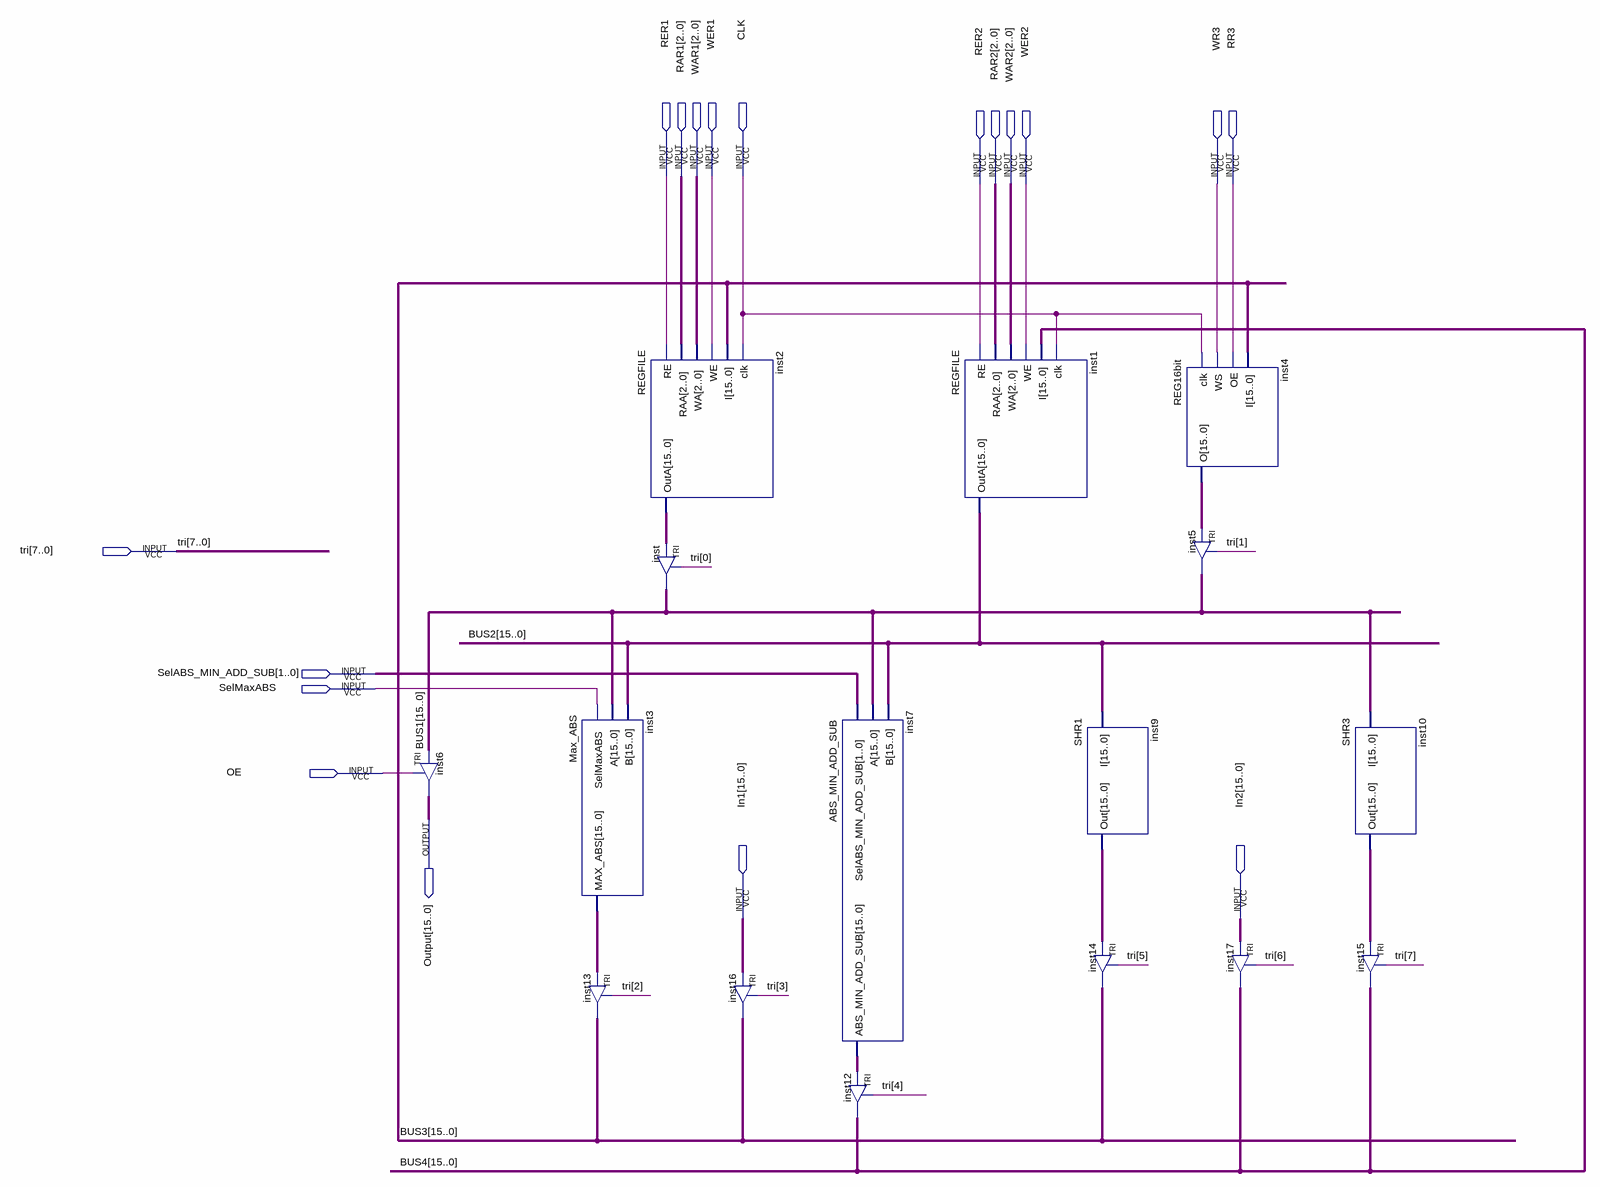
[diagram p0: schematic sheet]
// Quartus schematic Datapath.bdf as structural Verilog: 16 symbols, 18 pins
module Datapath (
  input  RER1,
  input  [2:0] RAR1,
  input  [2:0] WAR1,
  input  WER1,
  input  CLK,
  input  RER2,
  input  [2:0] RAR2,
  input  [2:0] WAR2,
  input  WER2,
  input  WR3,
  input  RR3,
  input  [7:0] \tri ,
  input  [1:0] SelABS_MIN_ADD_SUB,
  input  SelMaxABS,
  input  OE,
  input  [15:0] In1,
  input  [15:0] In2,
  output [15:0] Output
);

  wire [15:0] BUS1, BUS2, BUS3, BUS4, inst2_outa, inst3_max_abs, inst4_o, inst7_abs_min_add_sub, inst9_out,
       inst10_out;

  TRI inst6[15:0] (.IN(BUS1), .OE(OE), .OUT(Output));
  Max_ABS inst3 (.SelMaxABS(SelMaxABS), .A(BUS1), .B(BUS2), .MAX_ABS(inst3_max_abs));
  TRI inst13[15:0] (.IN(inst3_max_abs), .OE(\tri [2]), .OUT(BUS3));
  REGFILE inst2 (.RE(RER1), .RAA(RAR1), .WA(WAR1), .WE(WER1), .I(BUS3), .clk(CLK), .OutA(inst2_outa));
  TRI inst[15:0] (.IN(inst2_outa), .OE(\tri [0]), .OUT(BUS1));
  TRI inst16[15:0] (.IN(In1), .OE(\tri [3]), .OUT(BUS3));
  ABS_MIN_ADD_SUB inst7 (
    .SelABS_MIN_ADD_SUB(SelABS_MIN_ADD_SUB), .A(BUS1), .B(BUS2), .ABS_MIN_ADD_SUB(inst7_abs_min_add_sub));
  TRI inst12[15:0] (.IN(inst7_abs_min_add_sub), .OE(\tri [4]), .OUT(BUS4));
  REGFILE inst1 (.RE(RER2), .RAA(RAR2), .WA(WAR2), .WE(WER2), .I(BUS4), .clk(CLK), .OutA(BUS2));
  SHR1 inst9 (.I(BUS2), .Out(inst9_out));
  TRI inst14[15:0] (.IN(inst9_out), .OE(\tri [5]), .OUT(BUS3));
  REG16bit inst4 (.clk(CLK), .WS(WR3), .OE(RR3), .I(BUS3), .O(inst4_o));
  TRI inst5[15:0] (.IN(inst4_o), .OE(\tri [1]), .OUT(BUS1));
  TRI inst17[15:0] (.IN(In2), .OE(\tri [6]), .OUT(BUS4));
  SHR3 inst10 (.I(BUS1), .Out(inst10_out));
  TRI inst15[15:0] (.IN(inst10_out), .OE(\tri [7]), .OUT(BUS4));
endmodule
